# Altium project Ai-WB2-01S_Module.PrjPcb
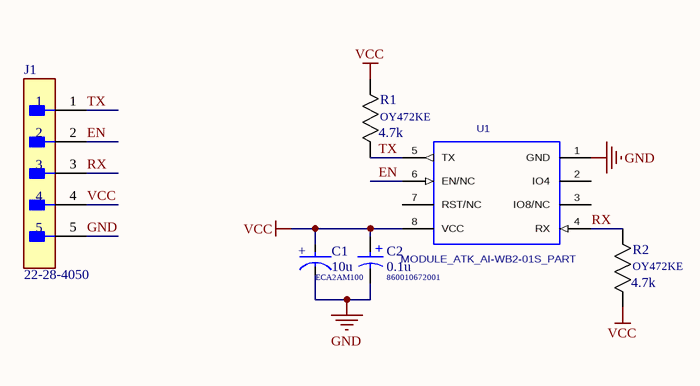
[diagram p0: Sheet1.SchDoc]
1 sheet, 6 parts. Net scope: global (net labels, ports and power ports of the same name join across sheets).
Board file: PCB1.PcbDoc

## Sheet Sheet1.SchDoc: Ai-WB2-01S Example Module
size A4; SheetNumber: 1; SheetTotal: 1

### Parts
C1  ECA2AM100  [FP-RAD-TH-D_5_0_5-L_11_1-MFG]
C2  860010672001  [WCAP-ATG8_D5H11]
J1  22-28-4050  [FP-22-28-4050-MFG]
R1  OY472KE  [RES_OY_OHM]
R2  OY472KE  [RES_OY_OHM]
U1  MODULE_ATK_AI-WB2-01S_PART  [MODULE_ATK_AI-WB2-01S_PCB]

### Nets
GND: C1.1(C) C2.2(N) J1.5 U1.1(GND)
VCC: C1.2(A) C2.1(P) J1.4 R1.2 R2.2 U1.8(VCC)
EN: J1.2 U1.6(EN/NC)
RX: J1.3 R2.1 U1.4(RX)
TX: J1.1 R1.1 U1.5(TX)

Not connected (* = marked no-connect by the designer): U1 2(IO4) 3(IO8/NC) 7(RST/NC)

### Notes on the sheet
- (near R1) 4.7k
- 10u
- (near C2) 0.1u
- (near R2) 4.7k
- (in symbol CMP-03913-54007254-1) +
- (in symbol CMP-05427-000869-1) +

### Library data of the parts
C1 = CMP-05427-000869-1: Aluminum Electrolytic Capacitors (Radial Lead Type) 10uF ±20% 100V; Polarity: Polar; Lead Diameter: 0.5mm; Dissipation Factor: 0.1%; Leakage Current: 3uA; Dielectric Material: Aluminium; Ripple Current: 70mA; Life (Hours): 2000Hour; Lead/Base Style: Straight; Length: 11mm; Case/Package: Radial; Lead Pitch: 2mm; Contact Plating: Tin; RoHS Compliant: Yes; Radiation Hardening: No; Capacitance: 10uF; Max Operating Temperature: 85°C; Lead Free: Lead Free; Termination: Radial; Voltage Rating: 100V; Package Quantity: 200; Voltage: 100V; Construction: RADIAL; Height: 11mm; Min Operating Temperature: -40°C; Diameter: 5mm; REACH SVHC: No SVHC; Tolerance: 20%; Width: 5mm; Height - Seated (Max): 0.472inch; Mount: Through Hole; Series: M; Voltage Rating (DC): 100V; Packaging: Bulk; Ripple Current (AC): 70mA; Number of Pins: 2
C2 = CMP-03913-54007254-1: 860010672001 Cap Aluminum Lytic 0.1uF 50V 20% (5 X 11mm) Radial 2mm 3.3mA 2000h 85C; Capacitance: 100nF; Polarity: Polar; Material: Aluminium; Life (Hours): 2000hours; Leakage Current: 3µA; Lead Pitch: 2.0066mm; Mount: Through Hole; Diameter: 5mm; RoHS: Compliant; Max Operating Temperature: 85°C; Case/Package: Radial; Packaging: Tape & Box (TB); REACH SVHC: Unknown; Pitch: 2mm; Ripple Current: 3.3mA; Tolerance: 20%; NexarPartId: 54007254; Voltage Rating (DC): 50V; Height: 11mm; Min Operating Temperature: -40°C; Height - Seated (Max): 12.4968mm; Length: 11mm; Voltage Rating: 50V
J1 = CMP-00257-00278173-1: 22-28-4050 KK® 254 Breakaway Header, Vertical, 5 Circuits, Tin (Sn) Plating, Mating Pin Length 6.09mm; NexarPartId: 278173; Voltage Rating: 250V; Number of Contacts: 5; Contact Resistance: 20mΩ; Gender: Male; Pitch: 2.54mm; Connector Type: Male Pin; Current Rating: 4A; Glow Wire Compliant: Non-compliant; Max Voltage Rating (DC): 250.25kV; Flammability Rating: UL94 V-0; Min Operating Temperature: 0°C; REACH SVHC: Unknown; Lead Free: Lead Free; Termination: Solder; RoHS: Compliant; Schedule B: 8536694040|8536694040|8536694040|8536694040|8536694040|8536694040|8536694040|8536694040|8536694040|8536694040|8536694040|8536694040|8536694040|8536694040|8536694040|8536694040|8536694040|8536694040|8536694040|8536694040|8536694040|8536694040|8536694040|85; Number of Circuits: 5; Mount: Through Hole; Lead Pitch: 2.54mm; Height: 2.29mm; Voltage Rating (DC): 250V; Max Operating Temperature: 75°C; Width: 2.49mm; Radiation Hardening: No; Contact Plating: Tin; Orientation: Vertical; Length: 12.7mm; Number of Rows: 1; Housing Material: Thermoplastic; Contact Material: Brass; Packaging: Bulk; Contact Mating Length: 6.096mm; Housing Color: Black; Color: Black; Number of Positions: 5
R1 R2 = OY472KE: No Description Available; Mfr_Name: Ohmite
U1 = MODULE_ATK_AI-WB2-01S_PART: PCB DECAL: MODULE_ATK_AI-WB2-01S_PCB